# Altium schematic sheet LCD_Keypad.SchDoc
size A
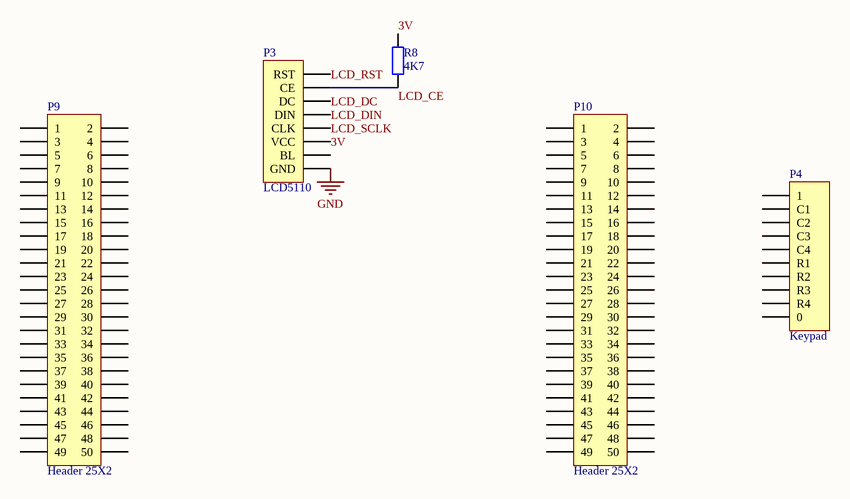
[diagram p0: LCD_Keypad.SchDoc]

## Parts
P3  LCD5110  [LCD 5110]
P4  Keypad  [Keypad 4x4]
P9  Header 25X2  [HDR2X25]
P10  Header 25X2  [HDR2X25]
R8  value 4K7  [AXIAL-0.4]  (hidden comment: Res2)

## Nets
GND: P3.8(GND)
3V: P3.6(VCC) R8.2
LCD_CE: P3.2(CE) R8.1
LCD_DC: P3.3(DC)
LCD_DIN: P3.4(DIN)
LCD_RST: P3.1(RST)
LCD_SCLK: P3.5(CLK)

Not connected (* = marked no-connect by the designer): P3 7(BL); P4 1 2(C1) 3(C2) 4(C3) 5(C4) 6(R1) 7(R2) 8(R3) 9(R4) 10(0); P9 1 2 3 4 5 6 7 8 9 10 11 12 13 14 15 16 17 18 19 20 21 22 23 24 25 26 27 28 29 30 31 32 33 34 35 36 37 38 39 40 41 42 43 44 45 46 47 48 49 50; P10 1 2 3 4 5 6 7 8 9 10 11 12 13 14 15 16 17 18 19 20 21 22 23 24 25 26 27 28 29 30 31 32 33 34 35 36 37 38 39 40 41 42 43 44 45 46 47 48 49 50

## Library data of the parts
P3 = Header 8: Header, 8-Pin; LatestRevisionDate: 17-Jul-2002; LatestRevisionNote: Re-released for DXP Platform.; Publisher: Altium Limited
P4 = Header 10: Header, 10-Pin; LatestRevisionDate: 17-Jul-2002; LatestRevisionNote: Re-released for DXP Platform.; Publisher: Altium Limited
P9 P10 = Header 25X2: Header, 25-Pin, Dual row; LatestRevisionDate: 17-Jul-2002; LatestRevisionNote: Re-released for DXP Platform.; Publisher: Altium Limited
R8 = Res2: Resistor; Published: 8-Jun-2000; LatestRevisionDate: 17-Jul-2002; LatestRevisionNote: Re-released for DXP Platform.; PackageReference: AXIAL-0.4; Publisher: Altium Limited; PackageDescription: Axial Device, Thru-Hole; 2 Leads; 0.4 in Pin Spacing